# EAGLE design 2WiresLink_BluePill (EAGLE 9.4.2)
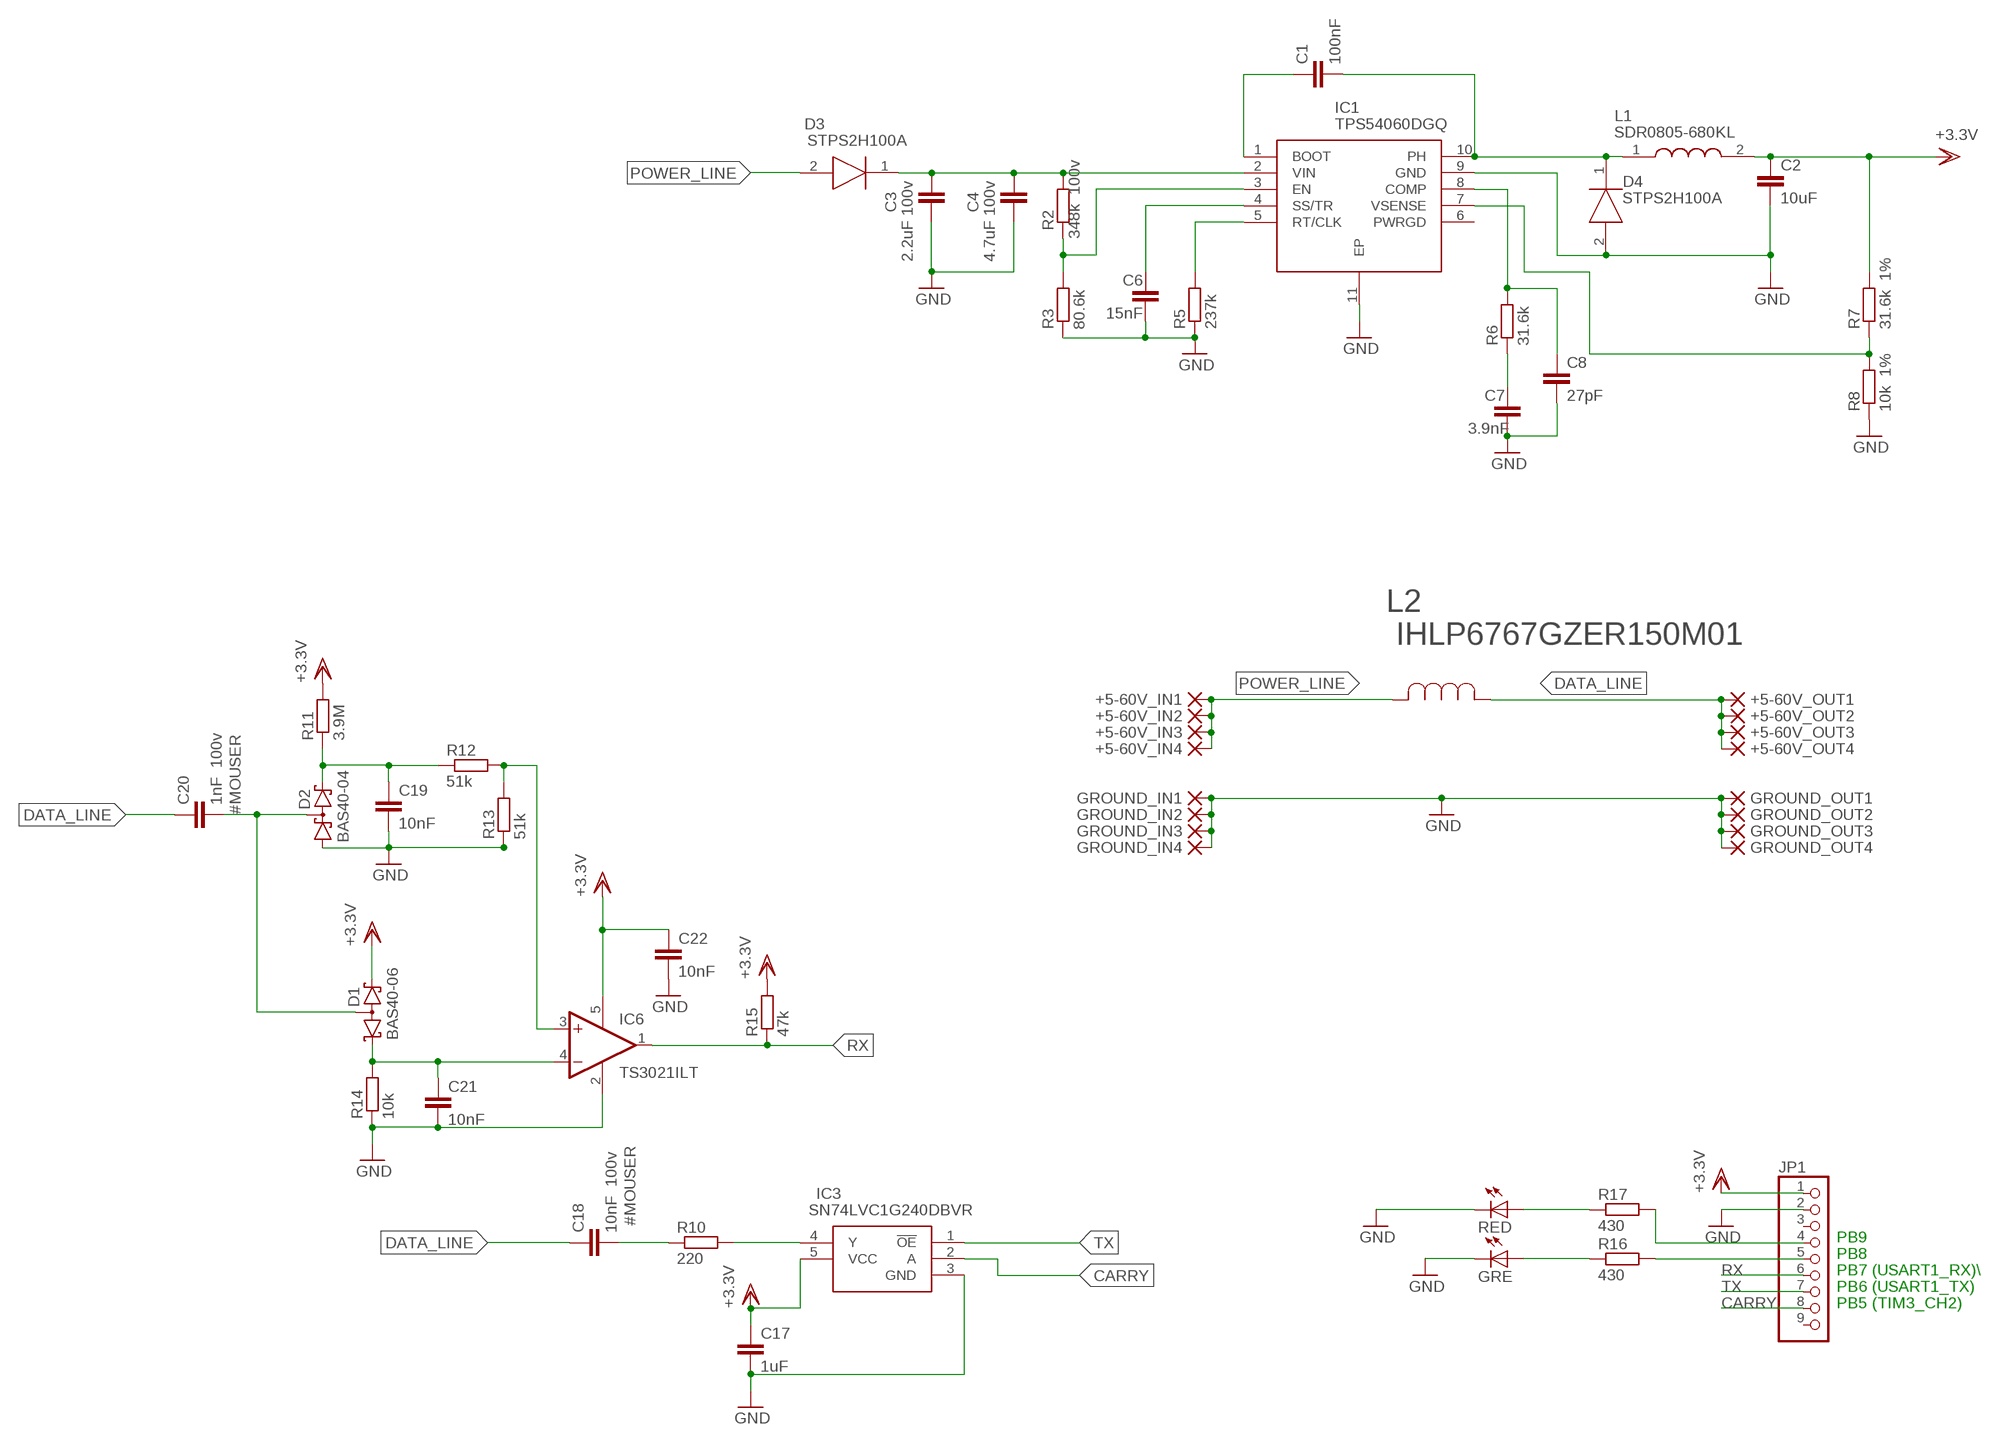
[diagram p0: schematic, sheet 1]

## Parts
+5-60V_IN1  PAD-0820-S  [0820-S]
+5-60V_IN2  PAD-0820-S  [0820-S]
+5-60V_IN3  PAD-0820-S  [0820-S]
+5-60V_IN4  PAD-0820-S  [0820-S]
+5-60V_OUT1  PAD-0820-S  [0820-S]
+5-60V_OUT2  PAD-0820-S  [0820-S]
+5-60V_OUT3  PAD-0820-S  [0820-S]
+5-60V_OUT4  PAD-0820-S  [0820-S]
C1  100nF  C-EUC0603  [C0603]
C2  10uF  C-EUC0603  [C0603]
C3  2.2uF 100v  C-EUC1210  [C1210]
C4  4.7uF 100v  C-EUC1210  [C1210]
C6  15nF  C-EUC0603  [C0603]
C7  3.9nF  C-EUC0603  [C0603]
C8  27pF  C-EUC0603  [C0603]
C17  1uF  C-EUC0603  [C0603]
C18  10nF 100v  C-EUC0603  [C0603]
C19  10nF  C-EUC0603  [C0603]
C20  1nF 100v  C-EUC0603  [C0603]
C21  10nF  C-EUC0603  [C0603]
C22  10nF  C-EUC0603  [C0603]
D1  BAS40-06  [SOT23]
D2  BAS40-04  [SOT23]
D3  STPS2H100A  [DIOM5126X265N]
D4  STPS2H100A  [DIOM5126X265N]
GRE  GRE  LEDCHIP-LED0805  [CHIP-LED0805]
GROUND_IN1  PAD-0820-S  [0820-S]
GROUND_IN2  PAD-0820-S  [0820-S]
GROUND_IN3  PAD-0820-S  [0820-S]
GROUND_IN4  PAD-0820-S  [0820-S]
GROUND_OUT1  PAD-0820-S  [0820-S]
GROUND_OUT2  PAD-0820-S  [0820-S]
GROUND_OUT3  PAD-0820-S  [0820-S]
GROUND_OUT4  PAD-0820-S  [0820-S]
IC1  TPS54060DGQ  [SOP50P490X110-11N]
IC3  SN74LVC1G240DBVR  [SOT95P280X145-5N]
IC6  TS3021ILT  [SOT95P280X145-5N]
JP1  PINHD-1X9  [1X09-BIG]
L1  SDR0805-680KL  [SDR0805-680KL]
L2  IHLP6767GZER150M01  [IND_IHLP-6767GZ]
R2  348k 100v  R-EU_R0603  [R0603]
R3  80.6k  R-EU_R0603  [R0603]
R5  237k  R-EU_R0603  [R0603]
R6  31.6k  R-EU_R0603  [R0603]
R7  31.6k 1%  R-EU_R0603  [R0603]
R8  10k 1%  R-EU_R0603  [R0603]
R10  220  R-EU_R0603  [R0603]
R11  3.9M  R-EU_R0603  [R0603]
R12  51k  R-EU_R0603  [R0603]
R13  51k  R-EU_R0603  [R0603]
R14  10k  R-EU_R0603  [R0603]
R15  47k  R-EU_R0603  [R0603]
R16  430  R-EU_R0603  [R0603]
R17  430  R-EU_R0603  [R0603]
RED  RED  LEDCHIP-LED0805  [CHIP-LED0805]

## Nets
CARRY: IC3.2(A) JP1.8
DATA_LINE: +5-60V_OUT1.P$1(P) +5-60V_OUT2.P$1(P) +5-60V_OUT3.P$1(P) +5-60V_OUT4.P$1(P) C18.1 C20.1 L2.1
GND: C2.2 C3.2 C4.2 C6.2 C7.2 C8.2 C17.2 C19.2 C21.2 C22.2 D2.1(A1) D4.2(A) GRE.C GROUND_IN1.P$1(P) GROUND_IN2.P$1(P) GROUND_IN3.P$1(P) GROUND_IN4.P$1(P) GROUND_OUT1.P$1(P) GROUND_OUT2.P$1(P) GROUND_OUT3.P$1(P) GROUND_OUT4.P$1(P) IC1.9(GND) IC1.11(EP) IC3.3(GND) IC6.2(V-) JP1.2 R3.1 R5.1 R8.1 R13.1 R14.1 RED.C
N$1: C1.2 D4.1(K) IC1.10(PH) L1.1
N$3: C1.1 IC1.1(BOOT)
N$4: C7.1 R6.1
N$5: C8.1 IC1.8(COMP) R6.2
N$6: IC1.3(EN) R2.1 R3.2
N$7: IC1.7(VSENSE) R7.1 R8.2
N$8: C3.1 C4.1 D3.1(K) IC1.2(VIN) R2.2
N$10: C6.1 IC1.4(SS/TR)
N$11: IC1.5(RT/CLK) R5.2
N$13: JP1.4 R17.2
N$14: JP1.5 R16.2
N$15: IC3.4(Y) R10.2
N$16: C18.2 R10.1
N$17: C19.1 D2.2(C2) R11.1 R12.1
N$18: IC6.3(+IN) R12.2 R13.2
N$19: C20.2 D1.3(AA) D2.3(C1A2)
N$20: C21.1 D1.1(K1) IC6.4(-IN) R14.2
N$23: GRE.A R16.1
N$24: R17.1 RED.A
POWER_LINE: +5-60V_IN1.P$1(P) +5-60V_IN2.P$1(P) +5-60V_IN3.P$1(P) +5-60V_IN4.P$1(P) D3.2(A) L2.2
RX: IC6.1(OUT) JP1.6 R15.1
TX: IC3.1(!OE) JP1.7
VDD: C2.1 C17.1 C22.1 D1.2(K2) IC3.5(VCC) IC6.5(V+) JP1.1 L1.2 R7.2 R11.2 R15.2 ; supply symbol labelled +3.3V
Unconnected: IC1.6(PWRGD) JP1.3 JP1.9

## Notes on the sheet
- PB9
- PB8
- PB7 (USART1_RX)\
- PB6 (USART1_TX)
- PB5 (TIM3_CH2)

## Library data of the parts
+5-60V_IN1-+5-60V_IN4 +5-60V_OUT1-+5-60V_OUT4 GROUND_IN1-GROUND_IN4 GROUND_OUT1-GROUND_OUT4 = dpads:PAD: WIRE PAD Standard US Drill Sizes and SMD pads; OC_FARNELL: unknown; OC_MOUSER: unknown; OC_NEWARK: unknown
C1 = rcl:C-EU: CAPACITOR, European symbol; MF: KEMET; MPN: C0603C104K5RECAUTO; OC_FARNELL: unknown; OC_MOUSER: 80-C0603C104K5REAUTO; OC_NEWARK: 68R4839; SPICEPREFIX: C
C2 = rcl:C-EU: CAPACITOR, European symbol; MF: Murata Electronics; MPN: GRM188R61A106KE69D; OC_FARNELL: unknown; OC_MOUSER: 81-GRM188R61A106KE9D; OC_NEWARK: unknown; SPICEPREFIX: C
C3 = rcl:C-EU: CAPACITOR, European symbol; MF: TDK; MPN: C3225X7R2A225K230AB; OC_FARNELL: unknown; OC_MOUSER: 810-C3225X7R2A225K; SPICEPREFIX: C
C4 = rcl:C-EU: CAPACITOR, European symbol; MF: TDK; MPN: CGA6M3X7S2A475K200AB; OC_FARNELL: unknown; OC_MOUSER: 810-CGA6M3X7S2A475K; SPICEPREFIX: C
C6 = rcl:C-EU: CAPACITOR, European symbol; MF: KEMET; MPN: C0603C153K5RACTU; OC_FARNELL: unknown; OC_MOUSER: 80-C0603C153K5R; OC_NEWARK: 02AH1269; SPICEPREFIX: C
C7 = rcl:C-EU: CAPACITOR, European symbol; MF: Murata Electronics; MPN: GCM1885C1H392JA16D; OC_FARNELL: unknown; OC_MOUSER: 81-GCM1885C1H392JA6D; OC_NEWARK: unknown; SPICEPREFIX: C
C8 = rcl:C-EU: CAPACITOR, European symbol; MF: AVX; MPN: 06035A270JAT2A; OC_FARNELL: unknown; OC_MOUSER: 581-06035A270J; OC_NEWARK: unknown; SPICEPREFIX: C
C17 = rcl:C-EU: CAPACITOR, European symbol; MF: AVX; MPN: 0603YD105KAT2A; OC_FARNELL: unknown; OC_MOUSER: 581-0603YD105K; OC_NEWARK: unknown; SPICEPREFIX: C
C18 = rcl:C-EU: CAPACITOR, European symbol; #MOUSER: 80-C0603X103K1R3316; MF: Murata Electronics; MPN: GCM188R72A103KA37D; OC_FARNELL: unknown; OC_MOUSER: 81-GCM188R72A103KA7D; OC_NEWARK: unknown; SPICEPREFIX: C
C19 C22 = rcl:C-EU: CAPACITOR, European symbol; MF: KEMET; MPN: C0603C103K5RACAUTO7411; OC_FARNELL: unknown; OC_MOUSER: 80-C0603C103K5RAUTLR; OC_NEWARK: unknown; SPICEPREFIX: C
C20 = rcl:C-EU: CAPACITOR, European symbol; #MOUSER: 80-C0603C102F1GAUTO; MF: AVX; MPN: 06031C102KAT2A; OC_FARNELL: unknown; OC_MOUSER: 581-06031C102K; OC_NEWARK: unknown; SPICEPREFIX: C
C21 = rcl:C-EU: CAPACITOR, European symbol; MF: KEMET; OC_FARNELL: unknown; OC_NEWARK: unknown; SPICEPREFIX: C
D1 = diode:BAS40-06: Silicon Schottky Diodes General-purpose diode for high-speed switching; MF: Vishay Semiconductors; MPN: BAS40-06-E3-08; OC_FARNELL: unknown; OC_MOUSER: 78-BAS40-06-E3-08; OC_NEWARK: unknown
D2 = diode:BAS40-04: Silicon Schottky Diodes General-purpose diode for high-speed switching; MF: Diodes Incorporated; MPN: BAS40-04-7-F; OC_FARNELL: unknown; OC_MOUSER: 621-BAS40-04-F; OC_NEWARK: unknown
D3 D4 = STPS2H100A:STPS2H100A: STPS2H100A, Schottky Diode, 2A max, 100V, 2-Pin, SMA Source: Datasheet <https://componentsearchengine.com/Datasheets/1/STPS2H100A.pdf>; DESCRIPTION: STPS2H100A, Schottky Diode, 2A max, 100V, 2-Pin, SMA; HEIGHT: 2.65mm; MANUFACTURER_NAME: STMicroelectronics; MANUFACTURER_PART_NUMBER: STPS2H100A; MF: STMicroelectronics; MOUSER_PART_NUMBER: 511-STPS2H100A; MOUSER_PRICE-STOCK: https://www.mouser.com/Search/Refine.aspx?Keyword=511-STPS2H100A; MPN: STPS2H100A; OC_FARNELL: unknown; OC_MOUSER: 511-STPS2H100A; OC_NEWARK: unknown
GRE = adafruit:LED: LED OSRAM: - CHIPLED LG R971, LG N971, LY N971, LG Q971, LY Q971, LO R971, LY R971 LH N974, LH R974 LS Q976, LO Q976, LY Q976 LO Q996 - Hyper CHIPLED LW Q18S LB Q993, LB Q99A, LB R99A - SideLED LS A670, LO A670, LY A670, LG A670, LP A670 LB A673, LV A673, LT A673, LW A673 LH A674 LY A675 LS A676, LA A676, LO A676, LY A676, LW A676 LS A679, LY A679, LG A679 - Hyper Micro SIDELED® LS Y876, LA Y876, LO Y876, LY Y876 LT Y87S - SmartLED LW L88C, LW L88S LB L89C, LB L89S, LG L890 LS L89K, LO L89K, LY L89K LS L896, LA L896, LO L896, LY L896 - TOPLED LS T670, LO T670, LY T670, LG T670, LP T670 LSG T670, LSP T670, LSY T670, LOP T670, LYG T670 LG T671, LOG T671, LSG T671 LB T673, LV T673, LT T673, LW T673 LH T674 LS T676, LA T676, LO T676, LY T676, LB T676, LH T676, LSB T676, LW T676 LB T67C, LV T67C, LT T67C, LS T67K, LO T67K, LY T67K, LW E67C LS E67B, LA E67B, LO E67B, LY E67B, LB E67C, LV E67C, LT E67C LW T67C LS T679, LY T679, LG T679 LS T770, LO T770, LY T770, LG T770, LP T770 LB T773, LV T773, LT T773, LW T773 LH T774 LS E675, LA E675, LY E675, LS T675 LS T776, LA T776, LO T776, LY T776, LB T776 LHGB T686 LT T68C, LB T68C - Hyper Mini TOPLED® LB M676 - Mini TOPLED Santana® LG M470 LS M47K, LO M47K, LY M47K Source: http://www.osram.convergy.de/; MF: Lumex; MPN: SML-LXT0805GW-TR; OC_FARNELL: unknown; OC_MOUSER: 696-SML-LXT0805GW; OC_NEWARK: unknown
IC1 = TPS54060DGQ:TPS54060DGQ: 3.5V to 60V Input, 0.5A Step-Down Converter with Eco-Mode Source: Datasheet <http://www.ti.com/lit/ds/symlink/tps54060.pdf>; DESCRIPTION: 3.5V to 60V Input, 0.5A Step-Down Converter with Eco-Mode; HEIGHT: 1.1mm; MANUFACTURER_NAME: Texas Instruments; MANUFACTURER_PART_NUMBER: TPS54060DGQ; MF: Texas Instruments; MOUSER_PART_NUMBER: 595-TPS54060DGQ; MOUSER_PRICE-STOCK: https://www.mouser.com/Search/Refine.aspx?Keyword=595-TPS54060DGQ; MPN: TPS54060DGQR; OC_FARNELL: unknown; OC_MOUSER: 595-TPS54060DGQR; OC_NEWARK: unknown
IC3 = SN74LVC1G240DBVR:SN74LVC1G240DBVR: Single Inverting Buffer/Driver With 3-State Outputs Source: Datasheet <http://www.ti.com/lit/gpn/sn74lvc1g240>; DESCRIPTION: Single Inverting Buffer/Driver With 3-State Outputs; HEIGHT: 1.45mm; MANUFACTURER_NAME: Texas Instruments; MANUFACTURER_PART_NUMBER: SN74LVC1G240DBVR; MF: Texas Instruments; MOUSER_PART_NUMBER: 595-SN74LVC1G240DBVR; MOUSER_PRICE-STOCK: https://www.mouser.com/Search/Refine.aspx?Keyword=595-SN74LVC1G240DBVR; MPN: SN74LVC1G240DBVR; OC_FARNELL: unknown; OC_MOUSER: 595-SN74LVC1G240DBVR; OC_NEWARK: unknown
IC6 = TS3021ILT:TS3021ILT; MF: STMicroelectronics; MPN: TS3021ILT; OC_FARNELL: unknown; OC_MOUSER: 511-TS3021ILT; OC_NEWARK: unknown
JP1 = adafruit:PINHD-1X9: Pin header 1x10 0.1" spacing With round pins; OC_MOUSER: 855-M20-7820946
L1 = SDR0805-680KL:SDR0805-680KL: Bourns SDR0805 Series Wire-wound SMD Inductor with a Ferrite Core, 68uH +/-10% 850mA Idc Source: Datasheet <https://componentsearchengine.com/Datasheets/1/SDR0805-680KL.pdf>; DESCRIPTION: Bourns SDR0805 Series Wire-wound SMD Inductor with a Ferrite Core, 68 uH +/-10% 850mA Idc; HEIGHT: mm; MANUFACTURER_NAME: Bourns; MANUFACTURER_PART_NUMBER: SDR0805-680KL; MF: Bourns; MOUSER_PART_NUMBER: 652-SDR0805-680KL; MOUSER_PRICE-STOCK: https://www.mouser.com/Search/Refine.aspx?Keyword=652-SDR0805-680KL; MPN: SDR0805-680KL; OC_FARNELL: unknown; OC_MOUSER: 652-SDR0805-680KL; OC_NEWARK: unknown
L2 = IHLP6767GZER150M01:IHLP6767GZER150M01; MANUFACTURER_PART_NUMBER: IHLP6767GZER150M01; MF: Vishay / Dale; MPN: IHLP6767GZER150M01; OC_FARNELL: unknown; OC_MOUSER: 70-IHLP6767GZER150M0; OC_NEWARK: unknown; VENDOR: VISHAY
R2 = rcl:R-EU_: RESISTOR, European symbol; MF: Susumu; MPN: RG1608P-3483-D-T5; OC_FARNELL: unknown; OC_MOUSER: 754-RG1608P-3483DT5; OC_NEWARK: unknown; SPICEPREFIX: R
R3 = rcl:R-EU_: RESISTOR, European symbol; MF: Vishay / Dale; MPN: CRCW060380K6FKEA; OC_FARNELL: unknown; OC_MOUSER: 71-CRCW0603-80.6K-E3; OC_NEWARK: unknown; SPICEPREFIX: R
R5 = rcl:R-EU_: RESISTOR, European symbol; MF: Yageo; MPN: AC0603FR-07237KL; OC_FARNELL: unknown; OC_MOUSER: 603-AC0603FR-07237KL; OC_NEWARK: unknown; SPICEPREFIX: R
R6 R7 = rcl:R-EU_: RESISTOR, European symbol; MF: Yageo; MPN: AC0603FR-0731K6L; OC_FARNELL: unknown; OC_MOUSER: 603-AC0603FR-0731K6L; OC_NEWARK: unknown; SPICEPREFIX: R
R8 R14 = rcl:R-EU_: RESISTOR, European symbol; MF: Vishay / Dale; MPN: CRCW060310K0FKEAC; OC_FARNELL: unknown; OC_MOUSER: 71-CRCW060310K0FKEAC; OC_NEWARK: unknown; SPICEPREFIX: R
R10 = rcl:R-EU_: RESISTOR, European symbol; MF: Yageo; MPN: RC0603FR-07220RL; OC_FARNELL: unknown; OC_MOUSER: 603-RC0603FR-07220RL; OC_NEWARK: unknown; SPICEPREFIX: R
R11 = rcl:R-EU_: RESISTOR, European symbol; MF: Yageo; MPN: RC0603FR-073M9L; OC_FARNELL: unknown; OC_MOUSER: 603-RC0603FR-073M9L; OC_NEWARK: unknown; SPICEPREFIX: R
R12 R13 = rcl:R-EU_: RESISTOR, European symbol; MF: Yageo; MPN: RC0603FR-0751KL; OC_FARNELL: unknown; OC_MOUSER: 603-RC0603FR-0751KL; OC_NEWARK: unknown; SPICEPREFIX: R
R15 = rcl:R-EU_: RESISTOR, European symbol; MF: Yageo; MPN: RC0603FR-0747KL; OC_FARNELL: unknown; OC_MOUSER: 603-RC0603FR-0747KL; OC_NEWARK: unknown; SPICEPREFIX: R
R16 R17 = rcl:R-EU_: RESISTOR, European symbol; MF: Yageo; MPN: RC0603FR-07430RL; OC_FARNELL: unknown; OC_MOUSER: 603-RC0603FR-07430RL; OC_NEWARK: unknown; SPICEPREFIX: R
RED = adafruit:LED: LED OSRAM: - CHIPLED LG R971, LG N971, LY N971, LG Q971, LY Q971, LO R971, LY R971 LH N974, LH R974 LS Q976, LO Q976, LY Q976 LO Q996 - Hyper CHIPLED LW Q18S LB Q993, LB Q99A, LB R99A - SideLED LS A670, LO A670, LY A670, LG A670, LP A670 LB A673, LV A673, LT A673, LW A673 LH A674 LY A675 LS A676, LA A676, LO A676, LY A676, LW A676 LS A679, LY A679, LG A679 - Hyper Micro SIDELED® LS Y876, LA Y876, LO Y876, LY Y876 LT Y87S - SmartLED LW L88C, LW L88S LB L89C, LB L89S, LG L890 LS L89K, LO L89K, LY L89K LS L896, LA L896, LO L896, LY L896 - TOPLED LS T670, LO T670, LY T670, LG T670, LP T670 LSG T670, LSP T670, LSY T670, LOP T670, LYG T670 LG T671, LOG T671, LSG T671 LB T673, LV T673, LT T673, LW T673 LH T674 LS T676, LA T676, LO T676, LY T676, LB T676, LH T676, LSB T676, LW T676 LB T67C, LV T67C, LT T67C, LS T67K, LO T67K, LY T67K, LW E67C LS E67B, LA E67B, LO E67B, LY E67B, LB E67C, LV E67C, LT E67C LW T67C LS T679, LY T679, LG T679 LS T770, LO T770, LY T770, LG T770, LP T770 LB T773, LV T773, LT T773, LW T773 LH T774 LS E675, LA E675, LY E675, LS T675 LS T776, LA T776, LO T776, LY T776, LB T776 LHGB T686 LT T68C, LB T68C - Hyper Mini TOPLED® LB M676 - Mini TOPLED Santana® LG M470 LS M47K, LO M47K, LY M47K Source: http://www.osram.convergy.de/; MF: Lumex; MPN: SML-LXT0805IW-TR; OC_FARNELL: unknown; OC_MOUSER: 696-SML-LXT0805IW; OC_NEWARK: unknown

## Net classes
0 default: width 0.254 mm

## Board
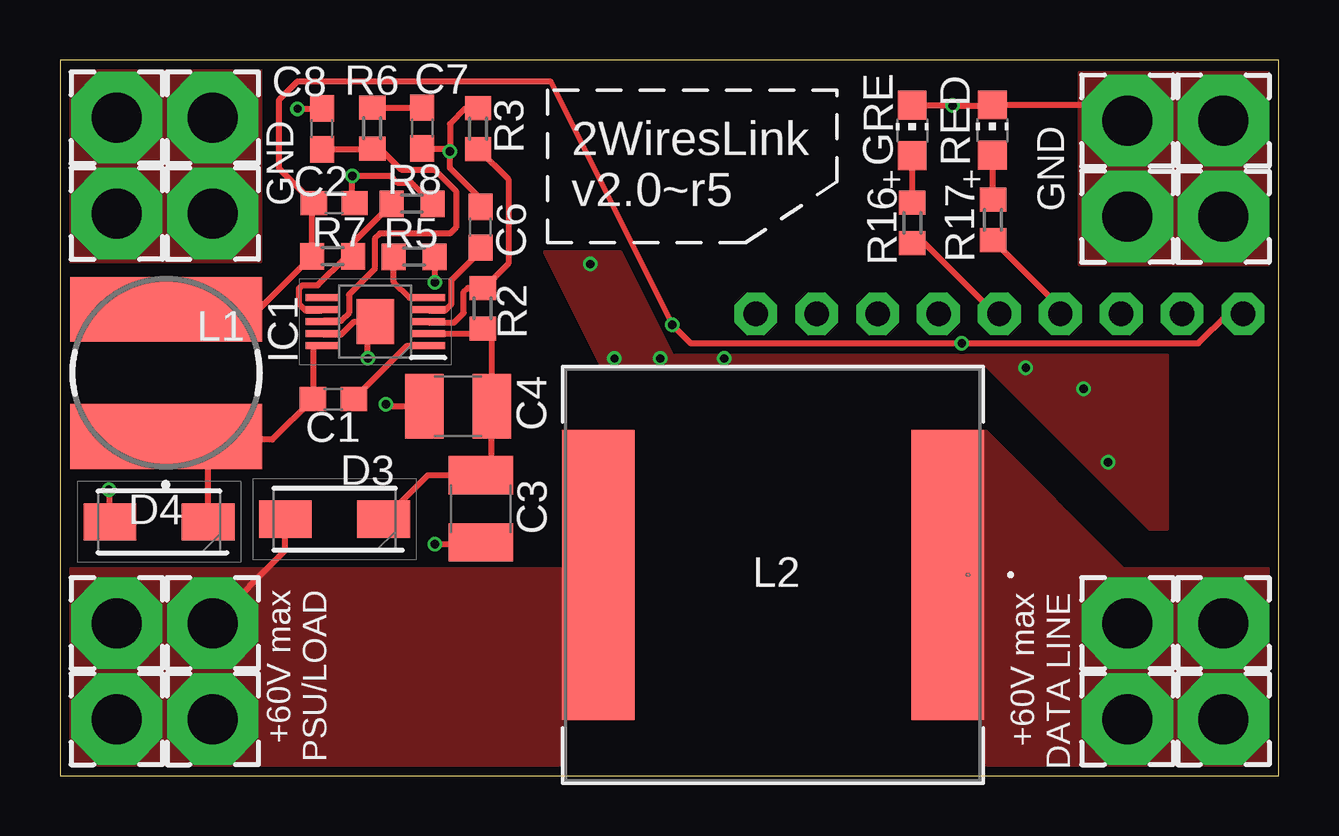
[diagram p1: board, top side]
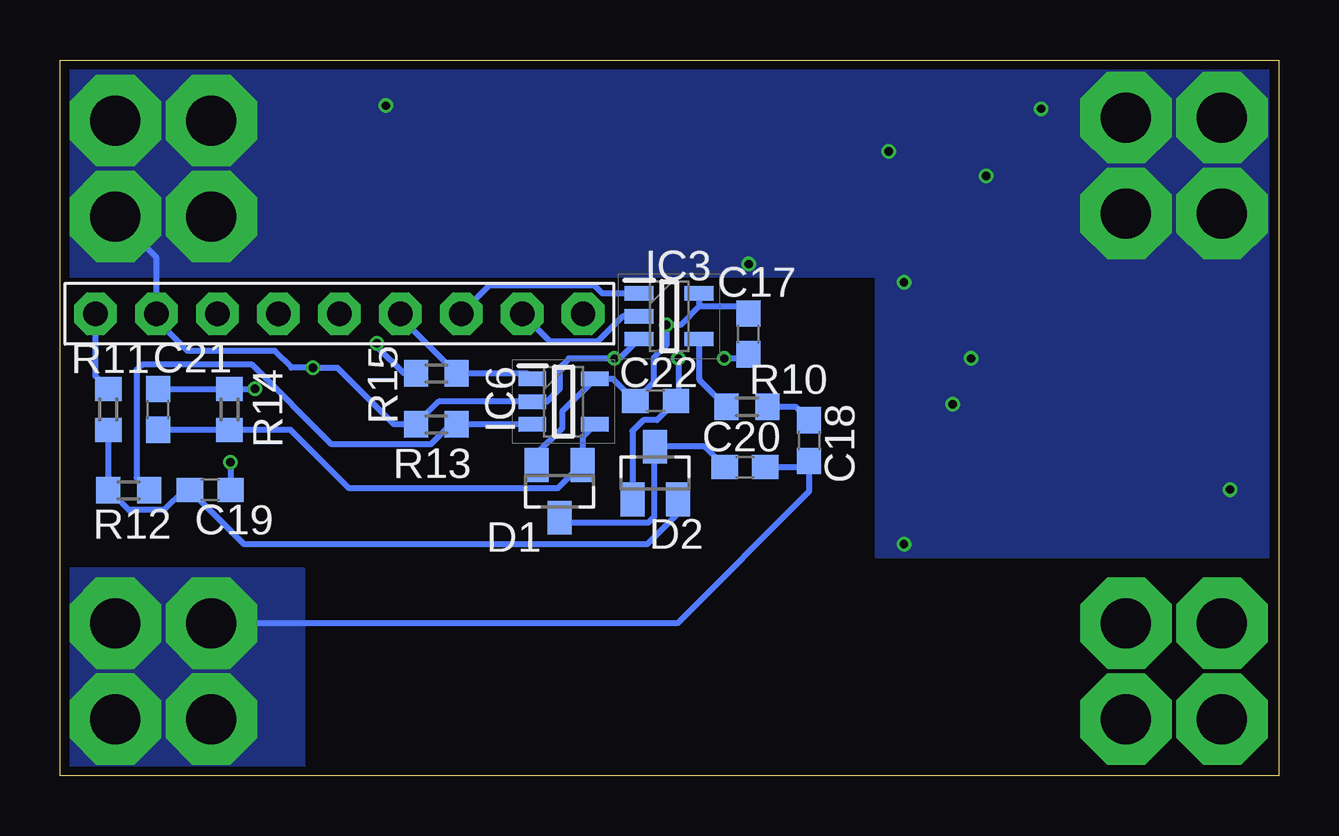
[diagram p2: board, bottom side, seen from below]

Size 50.8 x 29.84 mm. Coordinates in mm from the lower left corner, seen from the top.
Outline: 0,0 50.8,0 50.8,29.84 0,29.84 0,0
Copper layers (1*16): Top 0.035559375mm / dielectric 1.6mm / Bottom 0.035559375mm
Design rules "oshpark-2layer": minimum track width 6mil, minimum drill 10mil, track to track 6mil, track to pad 6mil, pad to pad 6mil, via to via 6mil, smd to smd 6mil, copper to edge 15mil, drill to drill 6mil, minimum pad ring 5mil, minimum via ring 5mil, stop-mask expansion 2.5mil, vias tented up to drill 0mil, thermal gap 10mil

### Footprints (pad centres in the part's own frame; a part is rotated, then mirrored left to right if it is on the bottom)
0820-S = drill 2.083 pad 3.81 octagon: P$1 0,0
C0603 = smd 1.1 x 1: 1 -0.85,0; 2 0.85,0
C1210 = smd 1.6 x 2.7: 1 -1.4,0; 2 1.4,0
SOT23 = smd 1 x 1.4: 1 -0.95,-1.1; 2 0.95,-1.1; 3 0,1.1
DIOM5126X265N = smd 2.2 x 1.55: 1 -2.05,0; 2 2.05,0
CHIP-LED0805 = smd 1.2 x 1.2: A 0,-1.05; C 0,1.05
SOP50P490X110-11N = smd 1.4 x 0.3: 1 -2.2,1; 2 -2.2,0.5; 3 -2.2,0; 4 -2.2,-0.5; 5 -2.2,-1; 6 2.2,-1; 7 2.2,-0.5; 8 2.2,0; 9 2.2,0.5; 10 2.2,1 | smd 1.57 x 1.88: 11 0,0
SOT95P280X145-5N = smd 1.2 x 0.6: 1 -1.25,0.95; 2 -1.25,0; 3 -1.25,-0.95; 4 1.25,-0.95; 5 1.25,0.95
SOT95P280X145-5N' = smd 1.15 x 0.6: 1 -1.3,0.95; 2 -1.3,0; 3 -1.3,-0.95; 4 1.3,-0.95; 5 1.3,0.95
1X09-BIG = drill 1.016 pad 1.778 octagon: 1 -10.16,0; 2 -7.62,0; 3 -5.08,0; 4 -2.54,0; 5 0,0; 6 2.54,0; 7 5.08,0; 8 7.62,0; 9 10.16,0
SDR0805-680KL = smd 8 x 2.7: 1 0,2.65; 2 0,-2.65
IND_IHLP-6767GZ = smd 3.023 x 12.09: 1 -7.277,0; 2 7.277,0
R0603 = smd 1 x 1.1: 1 -0.85,0; 2 0.85,0

### Placement (x,y rotation side)
+5-60V_IN1  2.37,6.37 0 top
+5-60V_IN2  6.37,6.37 0 top
+5-60V_IN3  2.37,2.37 0 top
+5-60V_IN4  6.37,2.37 0 top
+5-60V_OUT1  44.49,6.37 0 top
+5-60V_OUT2  44.49,2.37 0 top
+5-60V_OUT3  48.49,6.37 0 top
+5-60V_OUT4  48.49,2.37 0 top
C1  11.4,15.71 180 top
C2  11.43,23.88 0 top
C3  17.55,11.13 270 top
C4  16.59,15.41 180 top
C6  17.53,22.87 90 top
C7  15.09,27 270 top
C8  10.92,26.97 90 top
C17  22.11,18.42 270 bottom
C18  19.57,13.98 90 bottom
C19  44.54,11.92 0 bottom
C20  22.25,12.88 180 bottom
C21  46.7,15.28 90 bottom
C22  25.97,15.63 0 bottom
D1  29.98,11.86 180 bottom
D2  25.99,12.62 0 bottom
D3  11.45,10.7 180 top
D4  4.13,10.59 180 top
GRE  35.52,26.91 0 top
GROUND_IN1  2.37,27.44 0 top
GROUND_IN2  2.37,23.44 0 top
GROUND_IN3  6.37,27.44 0 top
GROUND_IN4  6.37,23.44 0 top
GROUND_OUT1  44.49,27.32 0 top
GROUND_OUT2  44.49,23.32 0 top
GROUND_OUT3  48.49,27.32 0 top
GROUND_OUT4  48.49,23.32 0 top
IC1  13.14,18.94 180 top
IC3  25.41,19.16 0 bottom
IC6  TS3021ILT  [SOT95P280X145-5N']  29.81,15.6 0 bottom
JP1  39.16,19.27 0 bottom
L1  4.43,16.8 180 top
L2  29.72,8.38 180 top
R2  17.62,19.49 270 top
R3  17.43,26.98 270 top
R5  14.77,21.64 180 top
R6  13.01,27 270 top
R7  11.36,21.66 180 top
R8  14.67,23.85 180 top
R10  22.17,15.39 180 bottom
R11  48.78,15.28 90 bottom
R12  47.94,11.9 0 bottom
R13  35.11,14.65 0 bottom
R14  43.73,15.28 270 bottom
R15  35.11,16.78 180 bottom
R16  35.52,23.05 270 top
R17  38.89,23.18 270 top
RED  38.86,26.92 0 top

### Tracks (layer width: path | path; a pad name or v marks a point on that pad's centre or on a via)
CARRY
  Bottom 0.254: IC3.2 27.33,19.16 28.39,18.1 30.37,18.1 JP1.8
DATA_LINE
  Bottom 0.254: +5-60V_OUT1.P$1 25.06,6.37 19.57,11.86 C18.1 19.82,12.88 C20.1
  pour Top (no thermals): 50.8,8.64 50.8,0 35.56,0 35.56,14.35 38.61,14.35 44.32,8.64
  pour Bottom (no thermals): 40.64,8.64 50.8,8.64 50.8,0 40.64,0
GND  (via drill 0.35)
  Top 0.254: D4.2 2.08,11.89 v2.03,11.94 | C3.2 17.47,9.65 v15.62,9.65 | 12.83,18.94 12.26,18.94 11.71,18.38 11,18.38 IC1.9 | 12.83,18.94 IC1.11 | C4.2 13.59,15.41 v13.59,15.49 | v12.83,17.4 12.83,18.94 | v9.91,27.81 C8.2 | C2.2 12.15,24 12.15,24.98 v12.19,25.02 13.78,25.02 14.06,24.74 14.63,24.74 R8.1 | C7.2 16.14,26.15 v16.26,26.04 | C6.2 17.53,24.06 16.26,25.34 v16.26,26.04 | R3.1 16.91,27.83 16.26,27.18 v16.26,26.04 | R5.1 v15.62,20.57 | RED.C 38.85,27.96 | RED.C 38.83,27.94 v37.21,27.94 35.54,27.94 GRE.C | RED.C 43.15,27.97 43.18,27.94
  Bottom 0.254: C17.2 22.28,17.4 v23.11,17.4 | v25.02,17.4 25.02,15.73 C22.2 25.93,14.83 26.48,14.83 26.94,14.37 D2.1 | IC3.3 27.47,17.4 v27.69,17.4 29.59,17.4 29.97,17.02 29.97,16.13 30.5,15.6 IC6.2 35.01,15.6 R13.1 36.88,14.65 39.24,17.02 v40.26,17.02 41.15,17.02 41.85,17.72 45.48,17.72 46.78,19.01 JP1.2 46.78,21.6 GROUND_OUT4.P$1 | R14.1 v42.67,16.13 C21.2 | C19.2 v43.69,13.08
  other vias: 22.1,21.34
  pour Top (no thermals): 0.36,29.44 8.37,29.44 8.37,21.44 0.36,21.44
  pour Top (no thermals): 42.49,29.32 50.49,29.32 50.49,21.32 42.49,21.32
  pour Top (no thermals): 46.16,17.53 22.73,17.53 22.73,17.14 38.54,17.14 45.4,10.29 46.16,10.29
  pour Top: 25.72,17.14 23.37,21.84 20.19,21.84 22.54,17.14
  pour Bottom (no thermals): 0,29.97 50.8,29.97 50.8,20.83 16.76,20.83 16.76,9.14 0,9.14
N$1
  Top 0.254: L1.1 4.47,14.02 6.3,14.02 | D4.1 6.18,13.8 6.35,13.97 6.3,14.02 | 6.3,14.02 8.85,14.02 C1.2 10.56,15.73 10.56,17.94 IC1.10
N$3
  Top 0.254: C1.1 14.47,17.94 IC1.1
N$4
  Top 0.254: R6.1 C7.1
N$5
  Top 0.254: C8.1 12.98,26.12 R6.2 13.34,26.15 14.22,25.27 15.62,25.27 16.51,24.38 16.51,22.86 16.26,22.61 13.34,22.61 13.12,22.39 13.12,21.13 12.05,20.05 12.05,19.3 11.72,18.97 10.98,18.97 IC1.8
N$6
  Top 0.254: IC1.3 15.4,18.88 16.41,18.88 16.83,19.3 16.83,20.17 17,20.34 R2.1 17.67,20.34 18.69,21.36 18.69,24.87 R3.2
N$7
  Top 0.254: IC1.7 10.89,19.38 10.25,19.38 9.96,19.67 9.96,20.32 10.1,20.45 10.75,20.45 11.88,21.59 12.21,21.59 R7.1 12.21,22.24 R8.2
N$8
  Top 0.254: D3.1 15.33,12.53 C3.1 17.99,12.98 C4.1 17.99,18.27 R2.2 17.41,18.44 IC1.2
N$10
  Top 0.254: IC1.4 15.4,19.38 16.03,19.38 16.32,19.67 16.32,20.67 17.53,21.88 C6.1
N$11
  Top 0.254: IC1.5 14.57,19.94 13.91,20.59 R5.2
N$13
  Top 0.254: R17.2 41.7,19.52 JP1.4
N$14
  Top 0.254: R16.2 36.03,22.2 38.97,19.27 JP1.5
N$15
  Bottom 0.254: IC3.4 24.16,16.53 R10.2
N$16
  Bottom 0.254: C18.2 20.13,15.39 R10.1
N$17
  Bottom 0.254: D2.2 25.04,10.94 26.33,9.65 43.12,9.65 C19.1 45.62,11.92 46.47,11.07 47.92,11.07 48.79,11.94 | R11.1 48.79,11.94 | 48.79,11.94 R12.1
N$18
  Bottom 0.254: IC6.3 R13.2 34.52,14.65 35.34,13.82 39.48,13.82 42.8,17.14 47.38,17.14 47.61,16.92 47.61,12.42 R12.2
N$19
  Bottom 0.254: C20.2 23.94,13.72 D2.3 26.04,13.68 26.04,10.79 26.29,10.54 29.76,10.54 D1.3
N$20
  Bottom 0.254: IC6.4 29.03,14.13 D1.1 29.08,12.96 30.06,11.98 38.75,11.98 41.19,14.43 R14.2 C21.1
N$23
  Top 0.254: R16.1 GRE.A
N$24
  Top 0.254: RED.A 38.86,24.06 R17.1
POWER_LINE
  Top 0.254: +5-60V_IN2.P$1 9.39,9.39 D3.2
  pour Top (no thermals): 0,0 23.88,0 23.88,14.35 21.08,14.35 21.08,8.64 0,8.64
RX
  Bottom 0.254: IC6.1 31.33,16.78 R15.1 36.62,19.13 JP1.6
TX
  Bottom 0.254: IC3.1 28.19,20.11 28.51,20.43 32.91,20.43 JP1.7
VDD  (via drill 0.35)
  Top 0.254: JP1.1 49.28,19.23 48.65,19.23 47.45,18.03 v37.59,18.03 26.29,18.03 v25.53,18.8 20.45,28.96 9.91,28.96 9.14,28.19 9.14,25.31 C2.1 10.51,23.81 R7.2 8.39,19.55 8.3,19.45 L1.2
  Bottom 0.254: IC3.5 24.16,19.56 | 24.16,19.56 24.92,18.8 v25.53,18.8 25.53,17.94 26.06,17.41 26.06,16.39 C22.1 27.74,16.55 IC6.5 29.87,15.19 29.87,14.49 30.93,13.44 D1.2 | R11.2 49.32,16.66 JP1.1 | C17.1 22.4,19.56 24.16,19.56 | R15.2 36.46,16.78 37.59,17.91 v37.59,18.03

### Text on the board
tPlace: GND | 2WiresLink / v2.0~r5 | GND | +60V max / PSU/LOAD | +60V max / DATA LINE